# EAGLE design DriverModule (EAGLE 9.6.2)
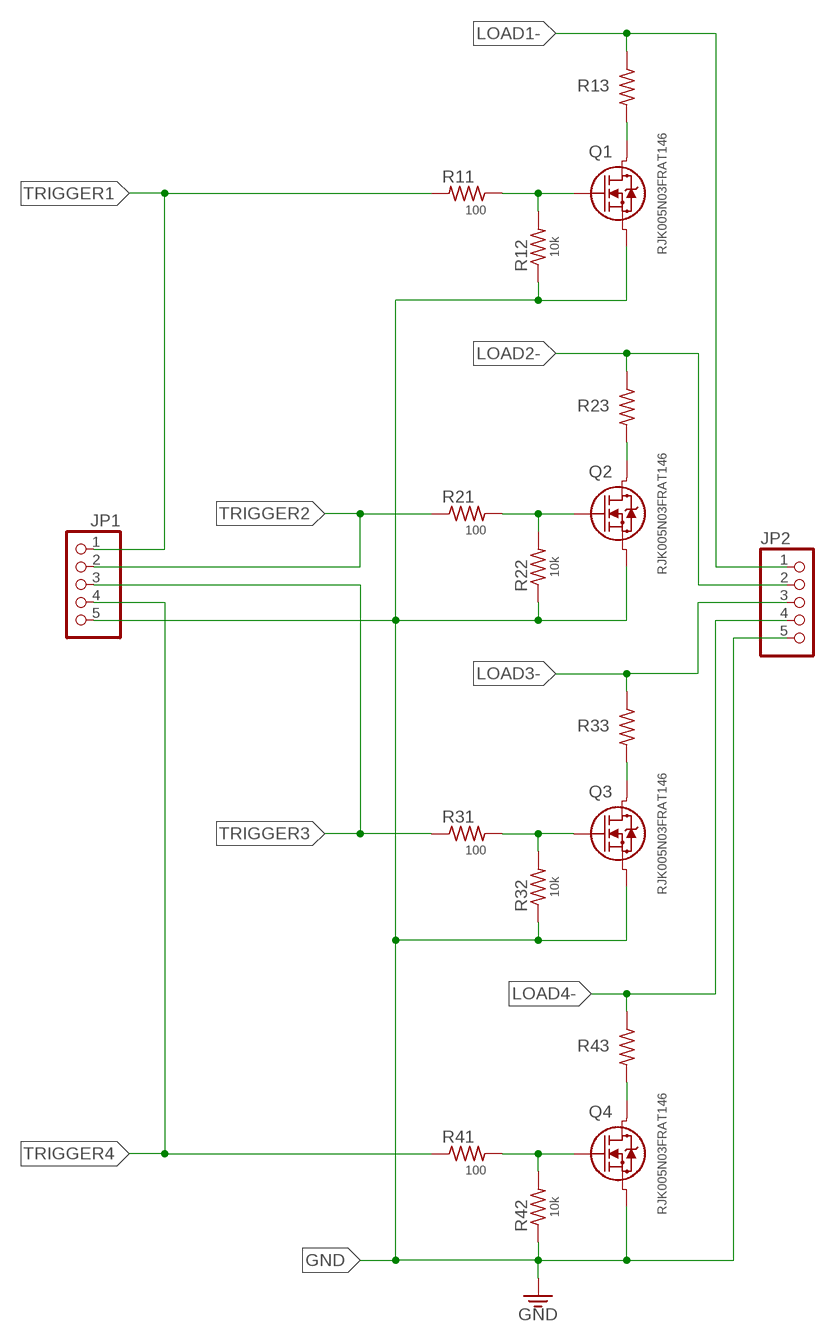
[diagram p0: schematic, sheet 1]

## Parts
JP1  HEADER-1X576MIL  [1X05_ROUND_76]
JP2  HEADER-1X576MIL  [1X05_ROUND_76]
Q1  RJK005N03FRAT146  RJK005N03FRAT146TRANS_RHK003N_ROM-M  [TRANS_RHK003N_ROM-M]
Q2  RJK005N03FRAT146  RJK005N03FRAT146TRANS_RHK003N_ROM-M  [TRANS_RHK003N_ROM-M]
Q3  RJK005N03FRAT146  RJK005N03FRAT146TRANS_RHK003N_ROM-M  [TRANS_RHK003N_ROM-M]
Q4  RJK005N03FRAT146  RJK005N03FRAT146TRANS_RHK003N_ROM-M  [TRANS_RHK003N_ROM-M]
R11  100  R-US_R0603  [R0603]
R12  10k  R-US_R0603  [R0603]
R13  R-US_R1206  [R1206]
R21  100  R-US_R0603  [R0603]
R22  10k  R-US_R0603  [R0603]
R23  R-US_R1206  [R1206]
R31  100  R-US_R0603  [R0603]
R32  10k  R-US_R0603  [R0603]
R33  R-US_R1206  [R1206]
R41  100  R-US_R0603  [R0603]
R42  10k  R-US_R0603  [R0603]
R43  R-US_R1206  [R1206]

## Nets
GATE1 [8mil]: Q1.2 R11.1 R12.2
GATE2 [8mil]: Q2.2 R21.2 R22.2
GATE3 [8mil]: Q3.2 R31.2 R32.2
GATE4 [8mil]: Q4.2 R41.2 R42.2
GND [8mil]: JP1.5 JP2.5 Q1.3 Q2.3 Q3.3 Q4.3 R12.1 R22.1 R32.1 R42.1
LD- [8mil]: Q4.1 R43.2
LD-1 [8mil]: Q3.1 R33.2
LD-2 [8mil]: Q2.1 R23.2
LD-3 [8mil]: Q1.1 R13.2
LOAD1- [8mil]: JP2.1 R13.1
LOAD2- [8mil]: JP2.2 R23.1
LOAD3- [8mil]: JP2.3 R33.1
LOAD4- [8mil]: JP2.4 R43.1
TRIGGER1 [8mil]: JP1.1 R11.2
TRIGGER2 [8mil]: JP1.2 R21.1
TRIGGER3 [8mil]: JP1.3 R31.1
TRIGGER4 [8mil]: JP1.4 R41.1

## Library data of the parts
JP1 JP2 = microbuilder:HEADER-1X5: PIN HEADER
Q1-Q4 = home:RJK005N03FRAT146; COPYRIGHT: Copyright (C) 2022 Ultra Librarian. All rights reserved.; DIGI-KEY_PART_NUMBER_1: RJK005N03FRAT146CT-ND; DIGI-KEY_PART_NUMBER_2: RJK005N03FRAT146DKR-ND; DIGI-KEY_PART_NUMBER_3: RJK005N03FRAT146TR-ND; MANUFACTURER_PART_NUMBER: RJK005N03FRAT146; MFR_NAME: ROHM Semiconductor
R11-R13 R21-R23 R31-R33 R41-R43 = adafruit:R-US_: RESISTOR, American symbol

## Net classes
1 8mil: width 0.203 mm

## Board
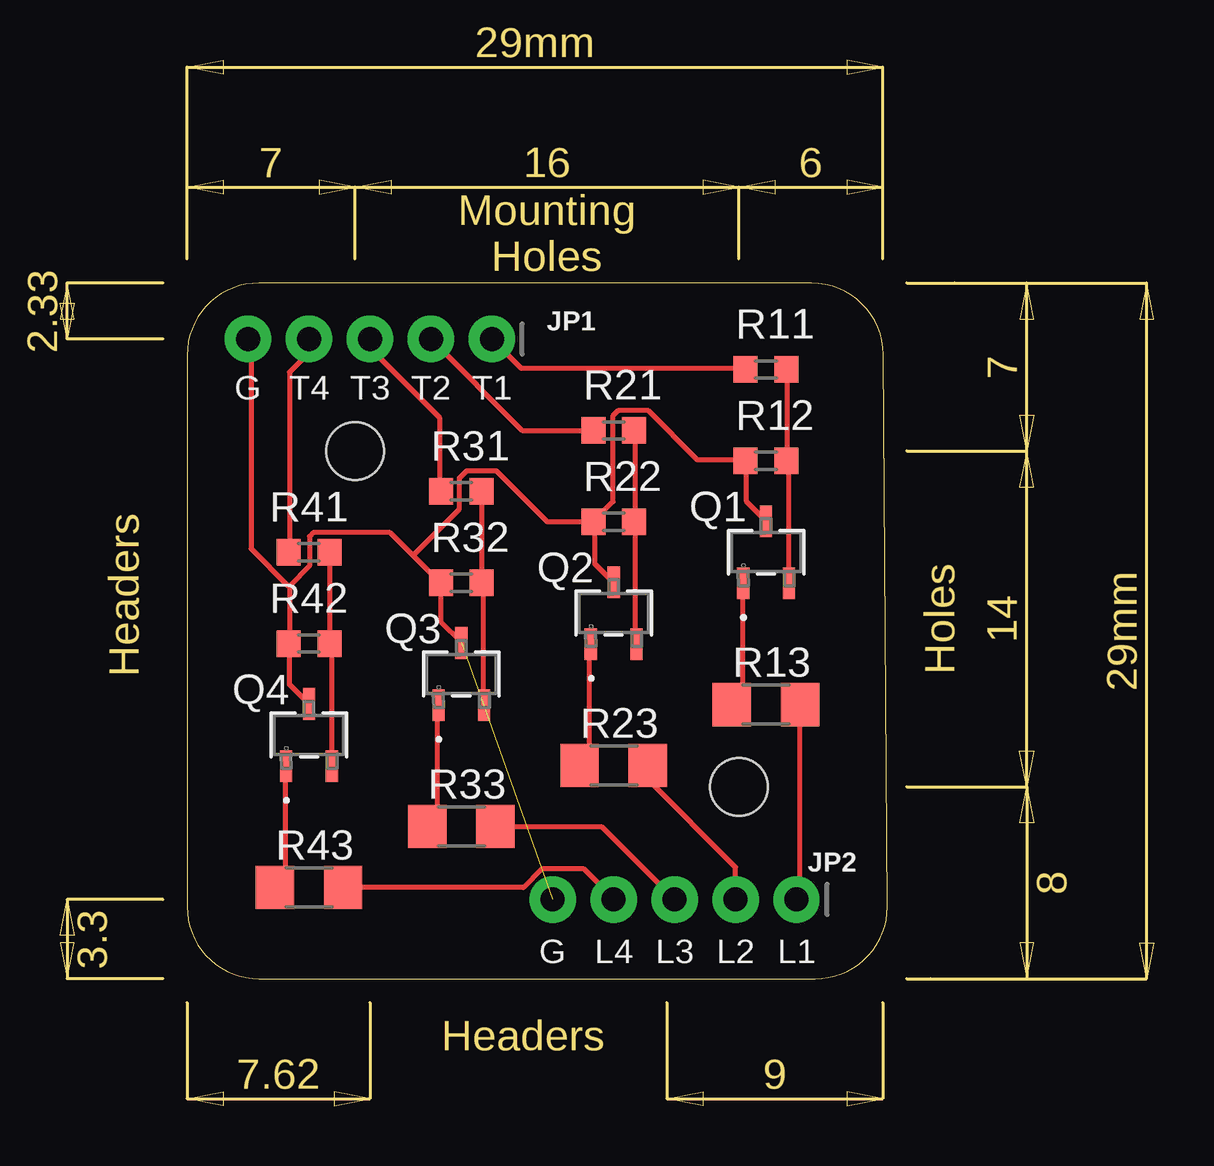
[diagram p1: board, top side]
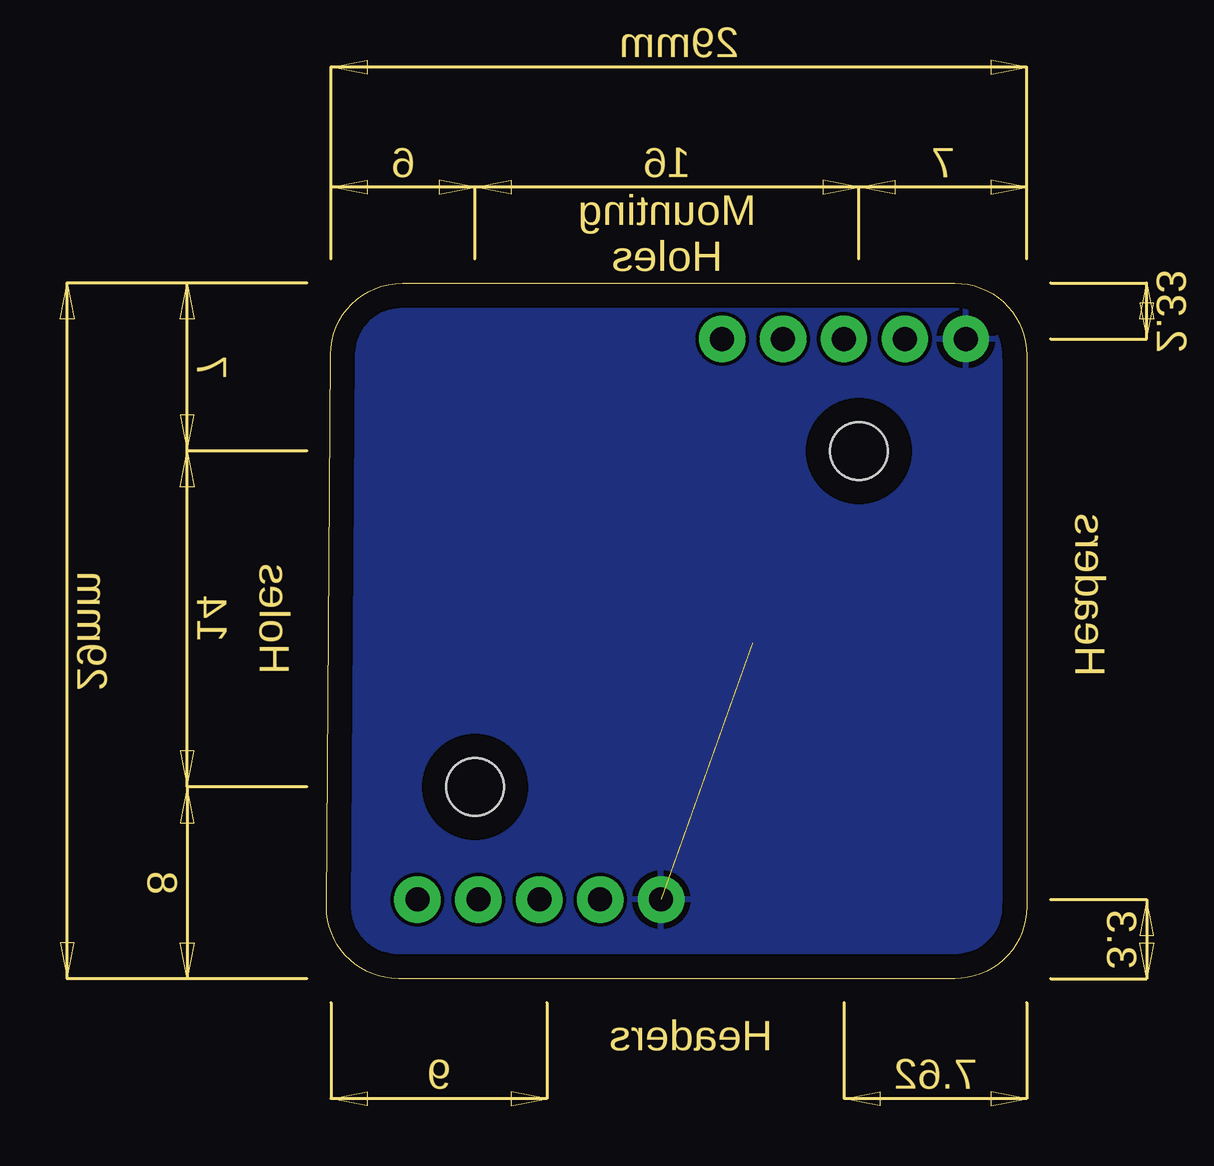
[diagram p2: board, bottom side, seen from below]

Size 29.19 x 29 mm. Coordinates in mm from the lower left corner, seen from the top.
Outline: 29.19,3 29.02,26.02 arc90 26.02,29 3,29 arc90 0,26 0,3 arc90 3,0 26.19,0 arc90 29.19,3
Copper layers (1*16): Top 0.035mm / dielectric 1.5mm / Bottom 0.035mm
Design rules "default": minimum track width 6mil, minimum drill 0.35mm, track to track 6mil, track to pad 6mil, pad to pad 6mil, via to via 6mil, smd to smd 6mil, copper to edge 40mil, drill to drill 6mil, minimum pad ring 10mil, minimum via ring 8mil, stop-mask expansion 4mil, vias tented up to drill 0mil, thermal gap 10mil
Holes 2.4 mm at 7,22 23,8

### Footprints (pad centres in the part's own frame; a part is rotated, then mirrored left to right if it is on the bottom)
1X05_ROUND_76 = drill 1 pad 1.93: 1 -5.08,0; 2 -2.54,0; 3 0,0; 4 2.54,0; 5 5.08,0
TRANS_RHK003N_ROM-M = smd 0.508 x 1.321: 1 -0.953,-1.295; 2 0.953,-1.295; 3 0,1.295
R0603 = smd 1 x 1.1: 1 -0.85,0; 2 0.85,0
R1206 = smd 1.6 x 1.803: 1 -1.422,0; 2 1.422,0

### Placement (x,y rotation side)
JP1  7.62,26.67 180 top
JP2  20.32,3.3 180 top
Q1  24.13,17.78 0 top
Q2  17.78,15.24 0 top
Q3  11.43,12.7 0 top
Q4  5.08,10.16 0 top
R11  24.13,25.4 180 top
R12  24.13,21.59 0 top
R13  24.13,11.43 180 top
R21  17.78,22.86 0 top
R22  17.78,19.05 0 top
R23  17.78,8.89 180 top
R31  11.43,20.32 0 top
R32  11.43,16.51 0 top
R33  11.43,6.35 180 top
R41  5.08,17.78 0 top
R42  5.08,13.97 0 top
R43  5.08,3.81 180 top

### Tracks (layer width: path | path; a pad name or v marks a point on that pad's centre or on a via)
GATE1
  Top 0.203: R11.1 24.99,25.38 24.99,21.64 R12.2 25.07,21.57 25.07,16.54 Q1.2
GATE2
  Top 0.203: R21.2 18.67,22.86 18.67,19.05 R22.2 18.67,18.97 18.67,13.95 Q2.2
GATE3
  Top 0.203: R31.2 12.27,20.27 12.27,16.54 R32.2 12.34,16.46 12.34,11.43 Q3.2
GATE4
  Top 0.203: R41.2 5.94,17.75 5.94,14.02 R42.2 6.02,13.95 6.02,8.91 Q4.2
GND  (1 unrouted)
  Top 0.203: Q1.3 23.32,19.89 23.32,21.57 R12.1 23.24,21.64 21.26,21.64 19.2,23.7 17.98,23.7 17.75,23.47 17.75,19.89 16.99,19.13 R22.1 | R22.1 16.99,19.05 16.99,17.3 17.75,16.54 Q2.3 | Q4.3 4.27,12.27 4.27,13.95 R42.1 4.27,14.02 4.27,16.38 | Q3.3 11.43,14.02 10.59,14.86 10.59,16.46 R32.1 10.52,16.54 9.41,17.64 | 4.27,16.38 5.11,17.22 5.11,18.44 5.26,18.59 8.46,18.59 9.41,17.64 | R22.1 15.01,19.05 12.88,21.18 11.66,21.18 11.35,20.88 11.35,19.58 9.41,17.64 | JP1.5 2.67,26.54 2.67,17.93 4.22,16.38 4.27,16.38
  pour Bottom: 0,0 0,29 29,29 29.02,29.46 29.19,0
LD-
  Top 0.203: Q4.1 4.12,8.84 4.12,4.19 3.73,3.81 R43.2
LD-1
  Top 0.203: Q3.1 10.44,11.35 10.44,6.78 10.06,6.4 R33.2
LD-2
  Top 0.203: Q2.1 16.76,13.95 16.76,9.3 16.38,8.91 R23.2
LD-3
  Top 0.203: Q1.1 23.16,16.46 23.16,11.81 22.78,11.43 R13.2
LOAD1-
  Top 0.203: JP2.1 25.55,3.45 R13.1
LOAD2-
  Top 0.203: JP2.2 22.86,4.65 19.2,8.31 R23.1 | R23.1
LOAD3-
  Top 0.203: R33.1 12.88,6.33 17.3,6.33 JP2.3
LOAD4-
  Top 0.203: R43.1 14.02,3.81 14.78,4.57 16.54,4.57 17.75,3.35 JP2.4
TRIGGER1
  Top 0.203: R11.2 23.23,25.45 13.92,25.45 JP1.1
TRIGGER2
  Top 0.203: JP1.2 13.97,22.86 R21.1
TRIGGER3
  Top 0.203: JP1.3 7.62,26.29 10.52,23.39 10.52,20.38 R31.1
TRIGGER4
  Top 0.203: JP1.4 5.08,26.11 4.27,25.3 4.27,17.82 R41.1

### Text on the board
Dimension: Mounting / Holes | Headers | Holes | Headers
tPlace: G | T4 | T3 | T2 | T1 | G | L4 | L3 | L2 | L1